# Altium schematic sheet module.SchDoc
size A
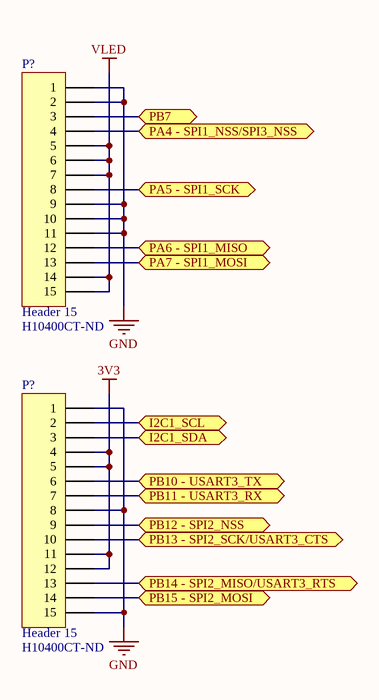
[diagram p0: module.SchDoc]

## Parts
(Parts that share a designator on the sheet are numbered #1, #2 ... from top to bottom, then left to right.)
P?#1  Header 15  Supplier Part Number 1: H10400CT-ND  [DF9-15P-1V]
P?#2  Header 15  Supplier Part Number 1: H10400CT-ND  [DF9-15P-1V]

## Ports
I2C1_SCL (bidir), I2C1_SDA (bidir), PA4 - SPI1_NSS/SPI3_NSS (bidir), PA5 - SPI1_SCK (bidir), PA6 - SPI1_MISO (bidir), PA7 - SPI1_MOSI (bidir), PB7 (bidir), PB10 - USART3_TX (bidir), PB11 - USART3_RX (bidir), PB12 - SPI2_NSS (bidir), PB13 - SPI2_SCK/USART3_CTS (bidir), PB14 - SPI2_MISO/USART3_RTS (bidir), PB15 - SPI2_MOSI (bidir)

## Nets
3V3: P?#2.4 P?#2.5 P?#2.11 P?#2.12
GND: P?#1.1 P?#1.2 P?#1.9 P?#1.10 P?#1.11 P?#2.1 P?#2.8 P?#2.15
VLED: P?#1.5 P?#1.6 P?#1.7 P?#1.14 P?#1.15
I2C1_SCL: P?#2.2 ; port I2C1_SCL
I2C1_SDA: P?#2.3 ; port I2C1_SDA
PA4 - SPI1_NSS/SPI3_NSS: P?#1.4 ; port PA4 - SPI1_NSS/SPI3_NSS
PA5 - SPI1_SCK: P?#1.8 ; port PA5 - SPI1_SCK
PA6 - SPI1_MISO: P?#1.12 ; port PA6 - SPI1_MISO
PA7 - SPI1_MOSI: P?#1.13 ; port PA7 - SPI1_MOSI
PB7: P?#1.3 ; port PB7
PB10 - USART3_TX: P?#2.6 ; port PB10 - USART3_TX
PB11 - USART3_RX: P?#2.7 ; port PB11 - USART3_RX
PB12 - SPI2_NSS: P?#2.9 ; port PB12 - SPI2_NSS
PB13 - SPI2_SCK/USART3_CTS: P?#2.10 ; port PB13 - SPI2_SCK/USART3_CTS
PB14 - SPI2_MISO/USART3_RTS: P?#2.13 ; port PB14 - SPI2_MISO/USART3_RTS
PB15 - SPI2_MOSI: P?#2.14 ; port PB15 - SPI2_MOSI

## Library data of the parts
P?#1 P?#2 = Header 15: Header, 15-Pin; LatestRevisionDate: 17-Jul-2002; LatestRevisionNote: Re-released for DXP Platform.; Publisher: Altium Limited; Supplier 1: Digi-Key